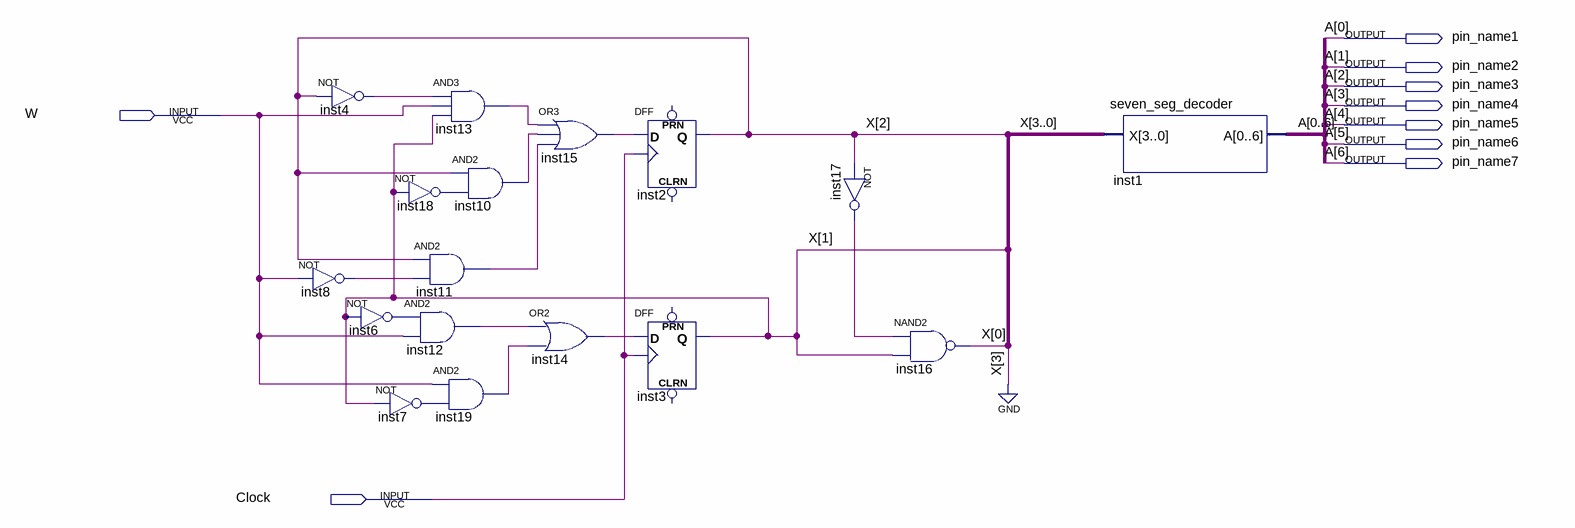
[diagram p0: schematic sheet]
// Quartus schematic lab11step2.bdf as structural Verilog: 17 symbols, 9 pins
module lab11step2 (
  input  W,
  input  Clock,
  output pin_name1,
  output pin_name2,
  output pin_name3,
  output pin_name4,
  output pin_name5,
  output pin_name6,
  output pin_name7
);

  wire inst4_out, inst6_out, inst7_out, inst8_out, inst10_out, inst11_out, inst12_out, inst13_out,
       inst14_out, inst15_out, inst17_out, inst18_out, inst19_out;
  wire [2:0] X;

  not inst4 (inst4_out, X[2]);
  not inst8 (inst8_out, W);
  not inst6 (inst6_out, X[1]);
  not inst18 (inst18_out, X[1]);
  and inst11 (inst11_out, X[2], inst8_out);
  and inst12 (inst12_out, inst6_out, W);
  not inst7 (inst7_out, X[1]);
  and inst13 (inst13_out, inst4_out, W, X[1]);
  and inst10 (inst10_out, X[2], inst18_out);
  and inst19 (inst19_out, W, inst7_out);
  or inst15 (inst15_out, inst13_out, inst10_out, inst11_out);
  or inst14 (inst14_out, inst12_out, inst19_out);
  DFF inst2 (.CLK(Clock), .D(inst15_out), .Q(X[2]));  // open: CLRN, PRN
  DFF inst3 (.CLK(Clock), .D(inst14_out), .Q(X[1]));  // open: CLRN, PRN
  not inst17 (inst17_out, X[2]);
  nand inst16 (X[0], inst17_out, X[1]);
  seven_seg_decoder inst1 (
    .X({1'b0, X}), .A({pin_name1, pin_name2, pin_name3, pin_name4, pin_name5, pin_name6, pin_name7}));

  // Other names for the same wires on the sheet: A[6:0] = {pin_name7, pin_name6, pin_name5, pin_name4, pin_name3, pin_name2, pin_name1}
endmodule
